# Altium schematic sheet IC103.schdoc
size 191 x 182 mm
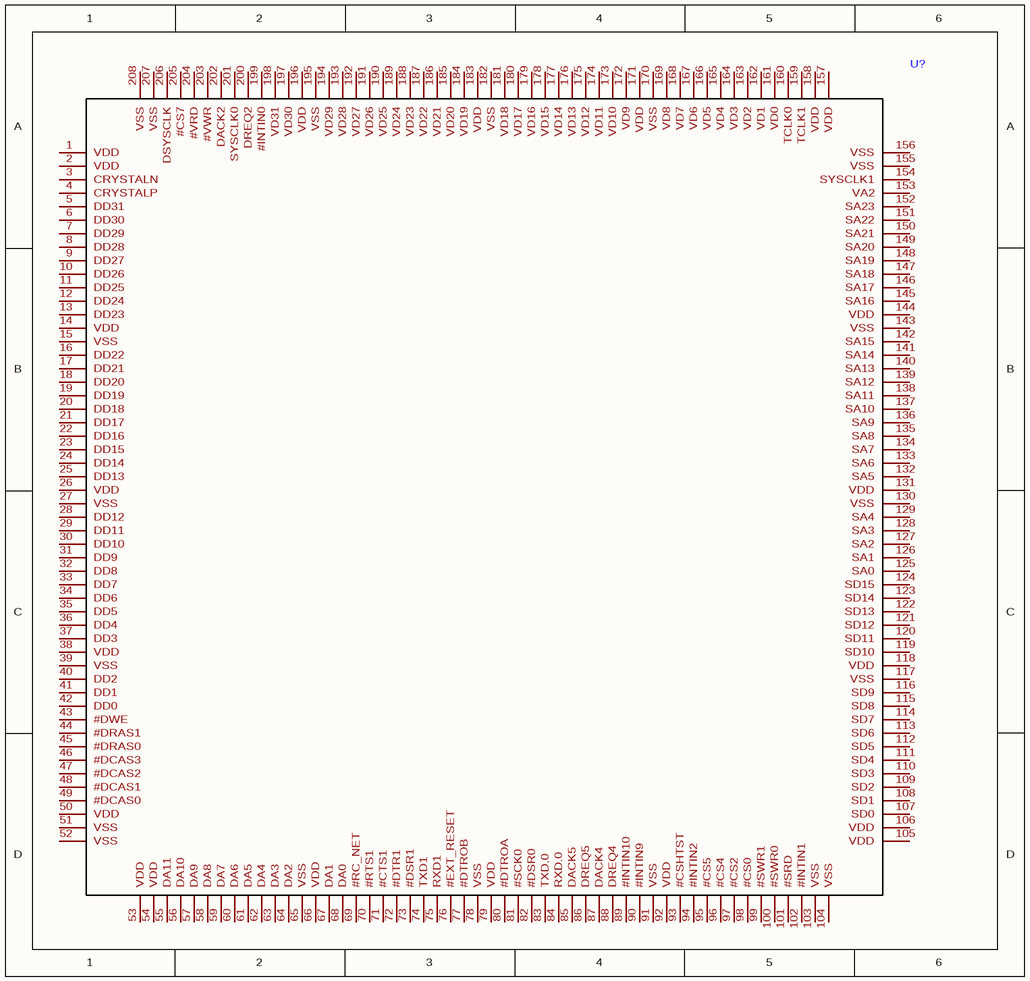
[diagram p0: IC103.schdoc]

## Parts
U?  (no value)  [LQFP-208_L28.0-W28.0-P0.50-LS30.0-BL]

## Nets

Not connected (* = marked no-connect by the designer): U? 1(VDD) 2(VDD) 3(CRYSTALN) 4(CRYSTALP) 5(DD31) 6(DD30) 7(DD29) 8(DD28) 9(DD27) 10(DD26) 11(DD25) 12(DD24) 13(DD23) 14(VDD) 15(VSS) 16(DD22) 17(DD21) 18(DD20) 19(DD19) 20(DD18) 21(DD17) 22(DD16) 23(DD15) 24(DD14) 25(DD13) 26(VDD) 27(VSS) 28(DD12) 29(DD11) 30(DD10) 31(DD9) 32(DD8) 33(DD7) 34(DD6) 35(DD5) 36(DD4) 37(DD3) 38(VDD) 39(VSS) 40(DD2) 41(DD1) 42(DD0) 43(#DWE) 44(#DRAS1) 45(#DRAS0) 46(#DCAS3) 47(#DCAS2) 48(#DCAS1) 49(#DCAS0) 50(VDD) 51(VSS) 52(VSS) 53(VDD) 54(VDD) 55(DA11) 56(DA10) 57(DA9) 58(DA8) 59(DA7) 60(DA6) 61(DA5) 62(DA4) 63(DA3) 64(DA2) 65(VSS) 66(VDD) 67(DA1) 68(DA0) 69(#RC_NET) 70(#RTS1) 71(#CTS1) 72(#DTR1) 73(#DSR1) 74(TXD1) 75(RXD1) 76(#EXT_RESET) 77(#DTROB) 78(VSS) 79(VDD) 80(#DTROA) 81(#SCK0) 82(#DSR0) 83(TXD.0) 84(RXD.0) 85(DACK5) 86(DREQ5) 87(DACK4) 88(DREQ4) 89(#INTIN10) 90(#INTIN9) 91(VSS) 92(VDD) 93(#CSHTST) 94(#INTIN2) 95(#CS5) 96(#CS4) 97(#CS2) 98(#CS0) 99(#SWR1) 100(#SWR0) 101(#SRD) 102(#INTIN1) 103(VSS) 104(VSS) 105(VDD) 106(VDD) 107(SD0) 108(SD1) 109(SD2) 110(SD3) 111(SD4) 112(SD5) 113(SD6) 114(SD7) 115(SD8) 116(SD9) 117(VSS) 118(VDD) 119(SD10) 120(SD11) 121(SD12) 122(SD13) 123(SD14) 124(SD15) 125(SA0) 126(SA1) 127(SA2) 128(SA3) 129(SA4) 130(VSS) 131(VDD) 132(SA5) 133(SA6) 134(SA7) 135(SA8) 136(SA9) 137(SA10) 138(SA11) 139(SA12) 140(SA13) 141(SA14) 142(SA15) 143(VSS) 144(VDD) 145(SA16) 146(SA17) 147(SA18) 148(SA19) 149(SA20) 150(SA21) 151(SA22) 152(SA23) 153(VA2) 154(SYSCLK1) 155(VSS) 156(VSS) 157(VDD) 158(VDD) 159(TCLK1) 160(TCLK0) 161(VD0) 162(VD1) 163(VD2) 164(VD3) 165(VD4) 166(VD5) 167(VD6) 168(VD7) 169(VD8) 170(VSS) 171(VDD) 172(VD9) 173(VD10) 174(VD11) 175(VD12) 176(VD13) 177(VD14) 178(VD15) 179(VD16) 180(VD17) 181(VD18) 182(VSS) 183(VDD) 184(VD19) 185(VD20) 186(VD21) 187(VD22) 188(VD23) 189(VD24) 190(VD25) 191(VD26) 192(VD27) 193(VD28) 194(VD29) 195(VSS) 196(VDD) 197(VD30) 198(VD31) 199(#INTIN0) 200(DREQ2) 201(SYSCLK0) 202(DACK2) 203(#VWR) 204(#VRD) 205(#CS7) 206(DSYSCLK) 207(VSS) 208(VSS)

## Library data of the parts
U? = IC103